# Altium project 智能柜控制模块.PrjPcb
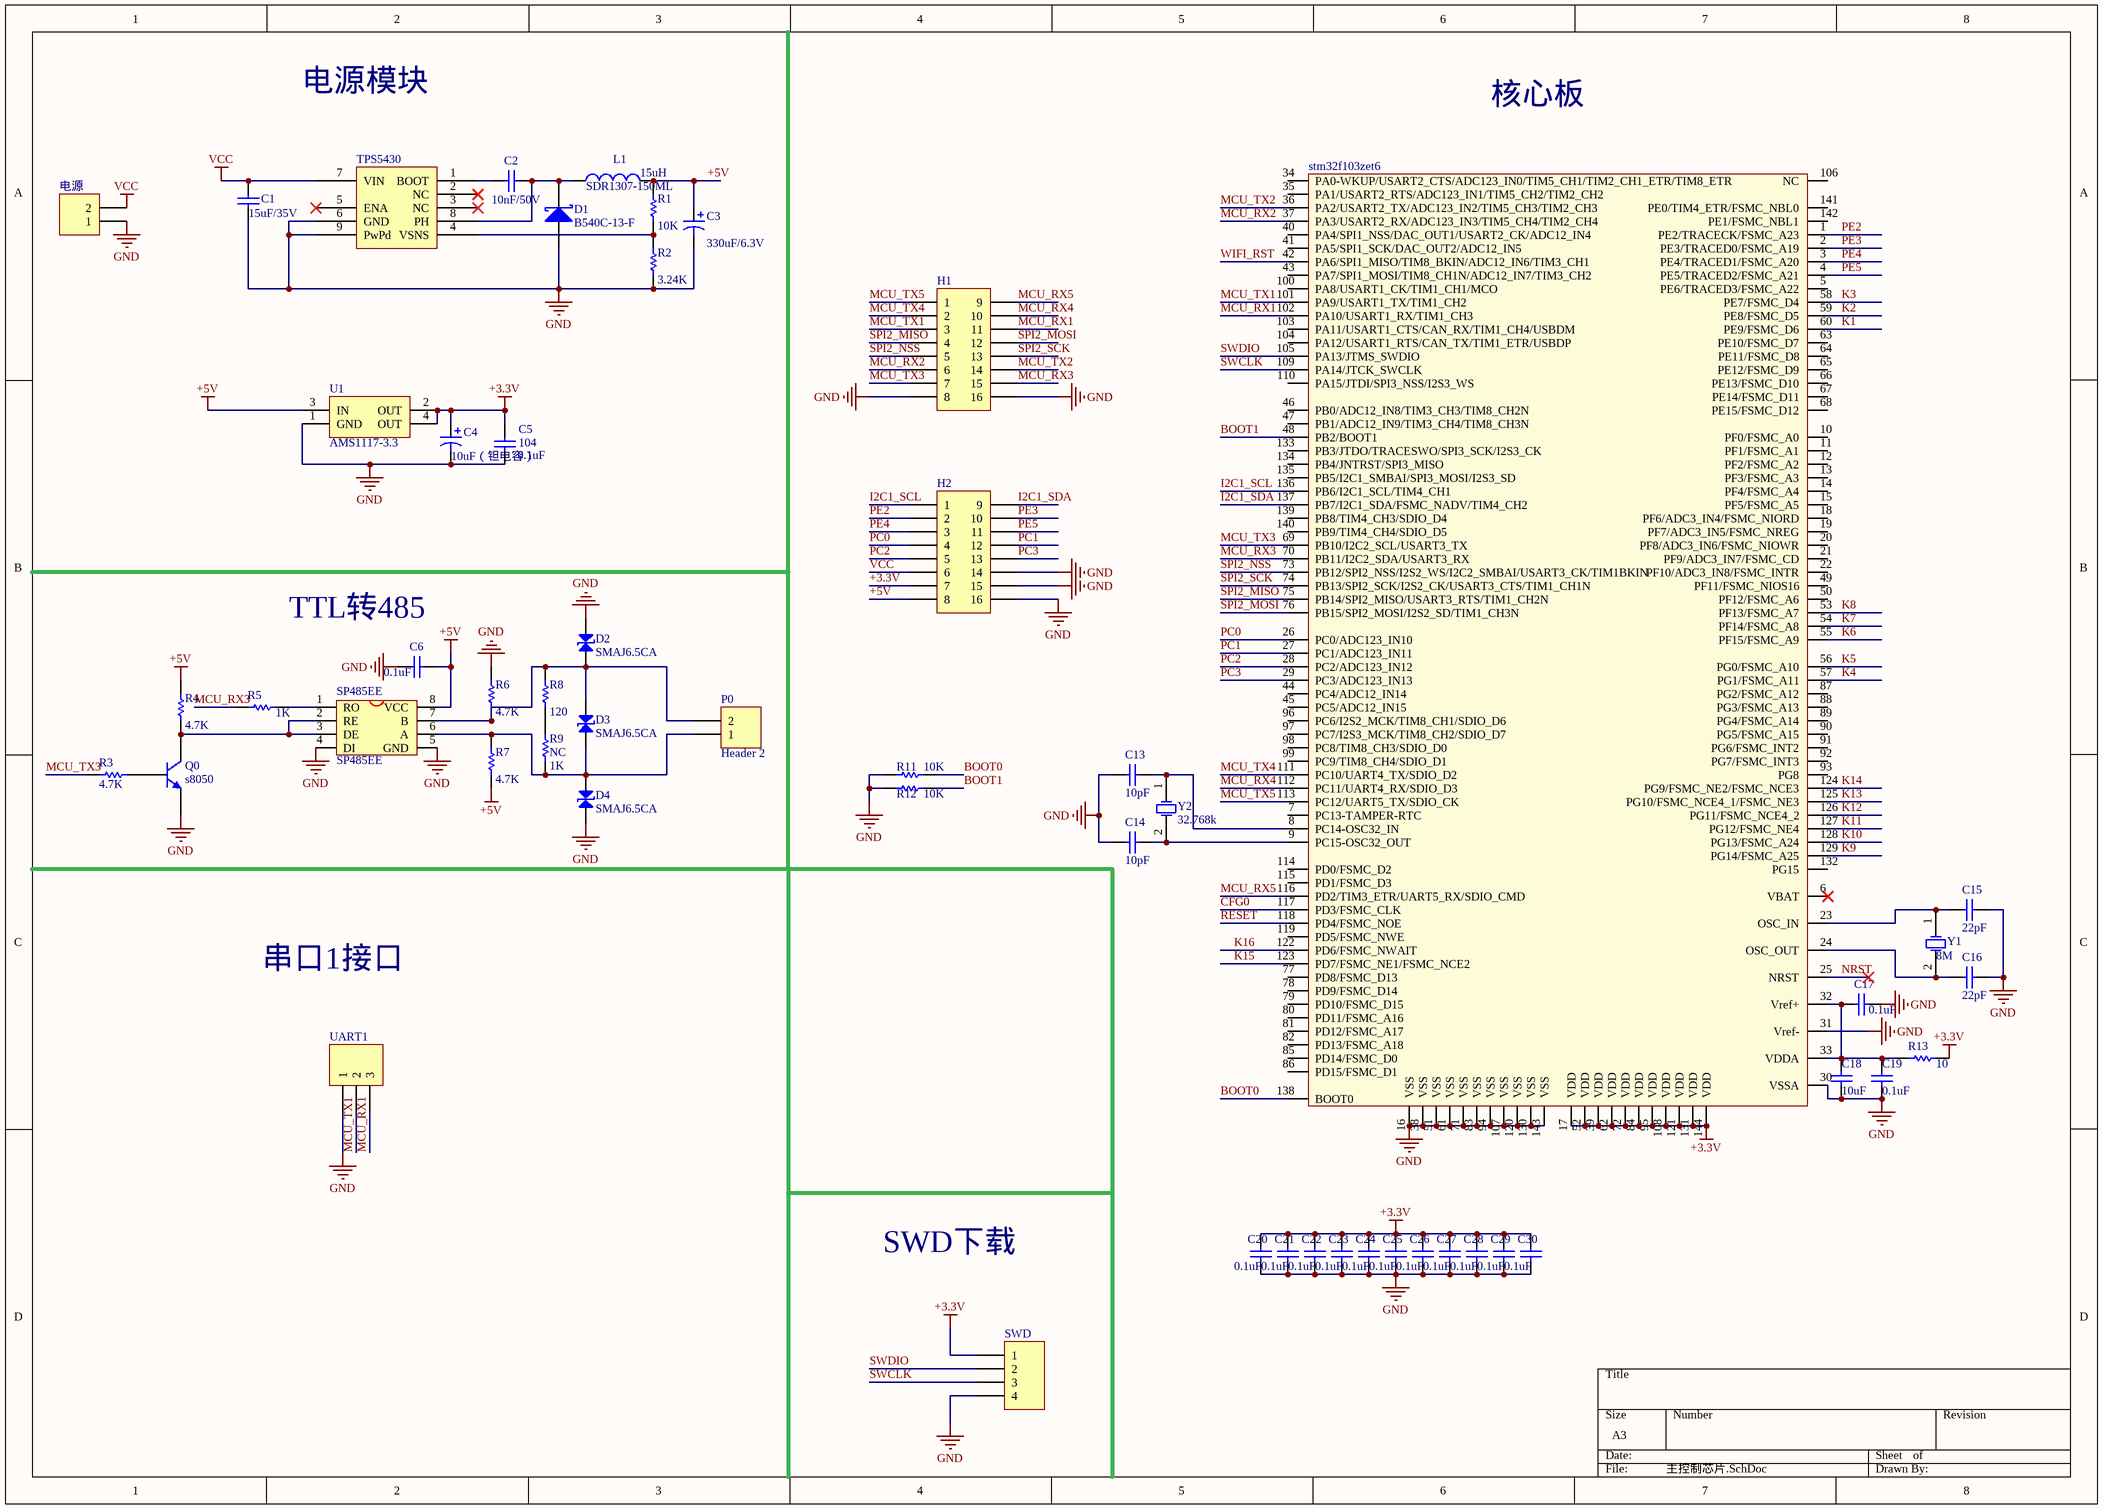
[diagram p0: 主控制芯片.SchDoc]
3 sheets, 230 parts. Net scope: global (net labels, ports and power ports of the same name join across sheets).
Board file: XNG_V1PCB.PcbDoc
Sheets:
  主控制芯片.SchDoc
  以太网透传模块.SchDoc
  继电器模块.SchDoc

## Sheet 主控制芯片.SchDoc
size A3

### Parts
C1  value 15uF/35V  [1206]  (hidden comment: C2012X5R1V156M125AC)
C2  value 10nF/50V  [0603]  (hidden comment: C0805C103K5RACTU)
C3  value 330uF/6.3V  [钽电容(D)]  (hidden comment: 6TPC330MA)
C4  10uF（钽电容）  [钽电容(B)]
C5  104  value 0.1uF  [0603]
C6  value 0.1uF  [0603]  (hidden comment: 104)
C13  value 10pF  [0603]  (hidden comment: 10)
C14  value 10pF  [0603]  (hidden comment: 10)
C15  value 22pF  [0603]  (hidden comment: 22)
C16  value 22pF  [0603]  (hidden comment: 22)
C17  value 0.1uF  [0603]  (hidden comment: 104)
C18  value 10uF  [0603]  (hidden comment: 106)
C19  value 0.1uF  [0603]  (hidden comment: 104)
C20  value 0.1uF  [0603]  (hidden comment: 104)
C21  value 0.1uF  [0603]  (hidden comment: 104)
C22  value 0.1uF  [0603]  (hidden comment: 104)
C23  value 0.1uF  [0603]  (hidden comment: 104)
C24  value 0.1uF  [0603]  (hidden comment: 104)
C25  value 0.1uF  [0603]  (hidden comment: 104)
C26  value 0.1uF  [0603]  (hidden comment: 104)
C27  value 0.1uF  [0603]  (hidden comment: 104)
C28  value 0.1uF  [0603]  (hidden comment: 104)
C29  value 0.1uF  [0603]  (hidden comment: 104)
C30  value 0.1uF  [0603]  (hidden comment: 104)
D1  B540C-13-F  [SMC]
D2  SMAJ6.5CA  [SMA]
D3  SMAJ6.5CA  [SMA]
D4  SMAJ6.5CA  [SMA]
H1  Header 8X2A  [HDR2X8_CEN]  (value not drawn)
H2  Header 8X2A  [HDR2X8_CEN]  (value not drawn)
L1  SDR1307-150ML  value 15uH  [CDRH127]
P0  Header 2  [电源]
Q0  s8050  [SOT-23]
R1  10K  [0603]
R2  3.24K  [0603]
R3  4.7k  [0603]
R4  4.7k  [0603]
R5  1K  [0603]
R6  4.7k  [0603]
R7  4.7k  [0603]
R8  120  [0603]
R9  NC  value 1K  [0603]
R11  10K  [0603]
R12  10K  [0603]
R13  10  [0603]
SP485EE  SP485EE  [SOP-8]
stm32f103zet6  stm32f103zet6  [LQFP144]  (value not drawn)
SWD  Header 4  [SWD]  (value not drawn)
TPS5430  TPS5430DDAR  [TPS5430]  (value not drawn)
U1  AMS1117-3.3  [1117-3.3]
UART1  Header 3  [H3]  (value not drawn)
Y1  8M  [5032(8M)]
Y2  32.768k  [FC135(32.768K)]
电源  DUANZI  [电源]  (value not drawn)

### Nets
+3.3V: C4.1 C5.2 C20.1 C21.1 C22.1 C23.1 C24.1 C25.1 C26.1 C27.1 C28.1 C29.1 C30.1 H2.7 R13.2 stm32f103zet6.17(VDD) stm32f103zet6.39(VDD) stm32f103zet6.52(VDD) stm32f103zet6.62(VDD) stm32f103zet6.72(VDD) stm32f103zet6.84(VDD) stm32f103zet6.95(VDD) stm32f103zet6.108(VDD) stm32f103zet6.121(VDD) stm32f103zet6.131(VDD) stm32f103zet6.144(VDD) SWD.1 U1.2(OUT) U1.4(OUT)
+5V: C3.1 C6.2 H2.8 L1.2 R1.2 R4.1 R7.2 SP485EE.8(VCC) U1.3(IN)
GND: C1.2 C3.2 C4.2 C5.1 C6.1 C13.2 C14.2 C15.1 C16.1 C17.1 C18.2 C19.2 C20.2 C21.2 C22.2 C23.2 C24.2 C25.2 C26.2 C27.2 C28.2 C29.2 C30.2 D1.1(A) D2.2 D4.1 H1.8 H1.16 H2.14 H2.15 H2.16 Q0.3(E) R2.1 R6.1 R11.2 R12.2 SP485EE.4(DI) SP485EE.5(GND) stm32f103zet6.16(VSS) stm32f103zet6.30(VSSA) stm32f103zet6.31(Vref-) stm32f103zet6.38(VSS) stm32f103zet6.51(VSS) stm32f103zet6.61(VSS) stm32f103zet6.71(VSS) stm32f103zet6.83(VSS) stm32f103zet6.94(VSS) stm32f103zet6.107(VSS) stm32f103zet6.120(VSS) stm32f103zet6.130(VSS) stm32f103zet6.143(VSS) SWD.4 TPS5430.6(GND) TPS5430.9(PwPd) U1.1(GND) UART1.1 电源.1
VCC: C1.1 H2.6 TPS5430.7(VIN) 电源.2
BOOT0: R11.1 stm32f103zet6.138(BOOT0)
BOOT1: R12.1 stm32f103zet6.48(PB2/BOOT1)
CFG0: stm32f103zet6.117(PD3/FSMC_CLK)
I2C1_SCL: H2.1 stm32f103zet6.136(PB6/I2C1_SCL/TIM4_CH1)
I2C1_SDA: H2.9 stm32f103zet6.137(PB7/I2C1_SDA/FSMC_NADV/TIM4_CH2)
K1: stm32f103zet6.60(PE9/FSMC_D6)
K2: stm32f103zet6.59(PE8/FSMC_D5)
K3: stm32f103zet6.58(PE7/FSMC_D4)
K4: stm32f103zet6.57(PG1/FSMC_A11)
K5: stm32f103zet6.56(PG0/FSMC_A10)
K6: stm32f103zet6.55(PF15/FSMC_A9)
K7: stm32f103zet6.54(PF14/FSMC_A8)
K8: stm32f103zet6.53(PF13/FSMC_A7)
K9: stm32f103zet6.129(PG14/FSMC_A25)
K10: stm32f103zet6.128(PG13/FSMC_A24)
K11: stm32f103zet6.127(PG12/FSMC_NE4)
K12: stm32f103zet6.126(PG11/FSMC_NCE4_2)
K13: stm32f103zet6.125(PG10/FSMC_NCE4_1/FSMC_NE3)
K14: stm32f103zet6.124(PG9/FSMC_NE2/FSMC_NCE3)
K15: stm32f103zet6.123(PD7/FSMC_NE1/FSMC_NCE2)
K16: stm32f103zet6.122(PD6/FSMC_NWAIT)
MCU_RX1: H1.11 stm32f103zet6.102(PA10/USART1_RX/TIM1_CH3) UART1.3
MCU_RX2: H1.6 stm32f103zet6.37(PA3/USART2_RX/ADC123_IN3/TIM5_CH4/TIM2_CH4)
MCU_RX3: H1.15 R5.1 stm32f103zet6.70(PB11/I2C2_SDA/USART3_RX)
MCU_RX4: H1.10 stm32f103zet6.112(PC11/UART4_RX/SDIO_D3)
MCU_RX5: H1.9 stm32f103zet6.116(PD2/TIM3_ETR/UART5_RX/SDIO_CMD)
MCU_TX1: H1.3 stm32f103zet6.101(PA9/USART1_TX/TIM1_CH2) UART1.2
MCU_TX2: H1.14 stm32f103zet6.36(PA2/USART2_TX/ADC123_IN2/TIM5_CH3/TIM2_CH3)
MCU_TX3: H1.7 R3.1 stm32f103zet6.69(PB10/I2C2_SCL/USART3_TX)
MCU_TX4: H1.2 stm32f103zet6.111(PC10/UART4_TX/SDIO_D2)
MCU_TX5: H1.1 stm32f103zet6.113(PC12/UART5_TX/SDIO_CK)
NRST: stm32f103zet6.25(NRST)
PC0: H2.4 stm32f103zet6.26(PC0/ADC123_IN10)
PC1: H2.12 stm32f103zet6.27(PC1/ADC123_IN11)
PC2: H2.5 stm32f103zet6.28(PC2/ADC123_IN12)
PC3: H2.13 stm32f103zet6.29(PC3/ADC123_IN13)
PE2: H2.2 stm32f103zet6.1(PE2/TRACECK/FSMC_A23)
PE3: H2.10 stm32f103zet6.2(PE3/TRACED0/FSMC_A19)
PE4: H2.3 stm32f103zet6.3(PE4/TRACED1/FSMC_A20)
PE5: H2.11 stm32f103zet6.4(PE5/TRACED2/FSMC_A21)
RESET: stm32f103zet6.118(PD4/FSMC_NOE)
SPI2_MISO: H1.4 stm32f103zet6.75(PB14/SPI2_MISO/USART3_RTS/TIM1_CH2N)
SPI2_MOSI: H1.12 stm32f103zet6.76(PB15/SPI2_MOSI/I2S2_SD/TIM1_CH3N)
SPI2_NSS: H1.5 stm32f103zet6.73(PB12/SPI2_NSS/I2S2_WS/I2C2_SMBAI/USART3_CK/TIM1BKIN)
SPI2_SCK: H1.13 stm32f103zet6.74(PB13/SPI2_SCK/I2S2_CK/USART3_CTS/TIM1_CH1N)
SWCLK: stm32f103zet6.109(PA14/JTCK_SWCLK) SWD.3
SWDIO: stm32f103zet6.105(PA13/JTMS_SWDIO) SWD.2
WIFI_RST: stm32f103zet6.42(PA6/SPI1_MISO/TIM8_BKIN/ADC12_IN6/TIM3_CH1)
NetC2_1: C2.1 TPS5430.1(BOOT)
NetC2_2: C2.2 D1.2(K) L1.1 TPS5430.8(PH)
NetC13_1: C13.1 stm32f103zet6.8(PC14-OSC32_IN) Y2.1(OSC1)
NetC14_1: C14.1 stm32f103zet6.9(PC15-OSC32_OUT) Y2.2(OSC2)
NetC15_2: C15.2 stm32f103zet6.23(OSC_IN) Y1.1(OSC1)
NetC16_2: C16.2 stm32f103zet6.24(OSC_OUT) Y1.2(OSC2)
NetC17_2: C17.2 C18.1 C19.1 R13.1 stm32f103zet6.32(Vref+) stm32f103zet6.33(VDDA)
NetD2_1: D2.1 D3.2 P0.2 R6.2 R8.2 SP485EE.7(B)
NetD3_1: D3.1 D4.2 P0.1 R7.1 R9.1 SP485EE.6(A)
NetQ0_1: Q0.1(C) R4.2 SP485EE.2(RE) SP485EE.3(DE)
NetQ0_2: Q0.2(B) R3.2
NetR1_1: R1.1 R2.2 TPS5430.4(VSNS)
NetR5_2: R5.2 SP485EE.1(RO)
NetR8_1: R8.1 R9.2

Not connected (* = marked no-connect by the designer): stm32f103zet6 5(PE6/TRACED3/FSMC_A22) 6(VBAT)* 7(PC13-TAMPER-RTC) 10(PF0/FSMC_A0) 11(PF1/FSMC_A1) 12(PF2/FSMC_A2) 13(PF3/FSMC_A3) 14(PF4/FSMC_A4) 15(PF5/FSMC_A5) 18(PF6/ADC3_IN4/FSMC_NIORD) 19(PF7/ADC3_IN5/FSMC_NREG) 20(PF8/ADC3_IN6/FSMC_NIOWR) 21(PF9/ADC3_IN7/FSMC_CD) 22(PF10/ADC3_IN8/FSMC_INTR) 34(PA0-WKUP/USART2_CTS/ADC123_IN0/TIM5_CH1/TIM2_CH1_ETR/TIM8_ETR) 35(PA1/USART2_RTS/ADC123_IN1/TIM5_CH2/TIM2_CH2) 40(PA4/SPI1_NSS/DAC_OUT1/USART2_CK/ADC12_IN4) 41(PA5/SPI1_SCK/DAC_OUT2/ADC12_IN5) 43(PA7/SPI1_MOSI/TIM8_CH1N/ADC12_IN7/TIM3_CH2) 44(PC4/ADC12_IN14) 45(PC5/ADC12_IN15) 46(PB0/ADC12_IN8/TIM3_CH3/TIM8_CH2N) 47(PB1/ADC12_IN9/TIM3_CH4/TIM8_CH3N) 49(PF11/FSMC_NIOS16) 50(PF12/FSMC_A6) 63(PE10/FSMC_D7) 64(PE11/FSMC_D8) 65(PE12/FSMC_D9) 66(PE13/FSMC_D10) 67(PE14/FSMC_D11) 68(PE15/FSMC_D12) 77(PD8/FSMC_D13) 78(PD9/FSMC_D14) 79(PD10/FSMC_D15) 80(PD11/FSMC_A16) 81(PD12/FSMC_A17) 82(PD13/FSMC_A18) 85(PD14/FSMC_D0) 86(PD15/FSMC_D1) 87(PG2/FSMC_A12) 88(PG3/FSMC_A13) 89(PG4/FSMC_A14) 90(PG5/FSMC_A15) 91(PG6/FSMC_INT2) 92(PG7/FSMC_INT3) 93(PG8) 96(PC6/I2S2_MCK/TIM8_CH1/SDIO_D6) 97(PC7/I2S3_MCK/TIM8_CH2/SDIO_D7) 98(PC8/TIM8_CH3/SDIO_D0) 99(PC9/TIM8_CH4/SDIO_D1) 100(PA8/USART1_CK/TIM1_CH1/MCO) 103(PA11/USART1_CTS/CAN_RX/TIM1_CH4/USBDM) 104(PA12/USART1_RTS/CAN_TX/TIM1_ETR/USBDP) 106(NC) 110(PA15/JTDI/SPI3_NSS/I2S3_WS) 114(PD0/FSMC_D2) 115(PD1/FSMC_D3) 119(PD5/FSMC_NWE) 132(PG15) 133(PB3/JTDO/TRACESWO/SPI3_SCK/I2S3_CK) 134(PB4/JNTRST/SPI3_MISO) 135(PB5/I2C1_SMBAI/SPI3_MOSI/I2S3_SD) 139(PB8/TIM4_CH3/SDIO_D4) 140(PB9/TIM4_CH4/SDIO_D5) 141(PE0/TIM4_ETR/FSMC_NBL0) 142(PE1/FSMC_NBL1); TPS5430 2(NC)* 3(NC)* 5(ENA)*

### Notes on the sheet
- 电源模块
- 核心板
- (near C6) TTL转485
- 串口1接口
- SWD下载

### Library data of the parts
C1 C2 C5 C6 C13-C30 = Cap: Capacitor; Published: 8-Jun-2000; LatestRevisionDate: 17-Jul-2002; LatestRevisionNote: Re-released for DXP Platform.; PackageReference: RAD-0.3; Publisher: Altium Limited
  C1 C2 C6 C17-C19: PackageDescription: Radial Cap, Thru-Hole; 2 Leads; 0.3 in Pin Spacing
C3 = Cap Pol1: Polarized Capacitor (Radial); Published: 8-Jun-2000; LatestRevisionDate: 17-Jul-2002; LatestRevisionNote: Re-released for DXP Platform.; PackageReference: RB7.6-15; Publisher: Altium Limited; PackageDescription: Polarized Capacitor (Radial); 2 Leads
C4 = Cap Pol1: Polarized Capacitor (Radial); Value: 10uF; Published: 8-Jun-2000; LatestRevisionDate: 17-Jul-2002; LatestRevisionNote: Re-released for DXP Platform.; PackageReference: RB7.6-15; Publisher: Altium Limited
D1 = D Schottky: Schottky Diode; Published: 8-Jun-2000; LatestRevisionDate: 17-Jul-2002; LatestRevisionNote: Re-released for DXP Platform.; PackageReference: SMB; Publisher: Altium Limited; PackageDescription: DO-214-AA/SMB; 2 C-Bend Leads; Body 5.3 x 3.6 mm, inc. leads (LxW); Code_JEDEC: DO-214-AA
D2-D4 = MSCJ6.5CA
H1 H2 = Header 8X2A: Header, 8-Pin, Dual row; LatestRevisionDate: 17-Jul-2002; LatestRevisionNote: Re-released for DXP Platform.; Publisher: Altium Limited
L1 = Inductor: Code_IEC: 1005; Published: 8-Jun-2000; LatestRevisionDate: 29-May-2009; LatestRevisionNote: IPC-7351 Footprint Added.; PackageReference: 0402-A; Publisher: Altium Limited; PackageDescription: Chip Inductor; Code_JEITA: 0402
P0 电源 = Header 2: Header, 2-Pin; LatestRevisionDate: 17-Jul-2002; LatestRevisionNote: Re-released for DXP Platform.; Publisher: Altium Limited
Q0 = NPN: NPN Bipolar Transistor; Published: 8-Jun-2000; LatestRevisionDate: 17-Jul-2002; LatestRevisionNote: Re-released for DXP Platform.; PackageReference: TO-226-AA; Publisher: Altium Limited; PackageDescription: TO, Flat Index; 3 In-Line, Axial Leads; Body Dia. 4.8mm; Leads 0.55 x 0.51 mm (max); Code_JEDEC: TO-226-AA
R1-R9 R11-R13 = Res1: Resistor; Published: 8-Jun-2000; LatestRevisionDate: 17-Jul-2002; LatestRevisionNote: Re-released for DXP Platform.; PackageReference: AXIAL-0.3; Publisher: Altium Limited; PackageDescription: Axial Device, Thru-Hole; 2 Leads; 0.3 in Pin Spacing
  R1 R11 R12: Value: 10K
  R2: Value: 3.24K
  R3 R4 R6 R7: Value: 4.7K
  R5: Value: 1K
  R8: Value: 120
  R13: Value: 10
SWD = Header 4: Header, 4-Pin; LatestRevisionDate: 17-Jul-2002; LatestRevisionNote: Re-released for DXP Platform.; Publisher: Altium Limited
TPS5430 = TPS5430
U1 = REG1117-3.3: 800mA and 1A Low Dropout Positive Regulator 2.85V, 3.3V, 5V, and Adjustable; Published: 8-Jun-2000; LatestRevisionDate: 17-Jul-2002; LatestRevisionNote: Re-released for DXP Platform.; DatasheetVersion: Sep-1997; PackageVersion: revC; PackageReference: ZZ311; Publisher: Altium Limited; PackageDescription: SOT-223/SC-73; 4 Leads; Body 6.7 x 7.3 mm, inc. leads (LxW max); ComponentLink1Description: Manufacturer Link; ComponentLink1URL: http://www.ti.com/; ComponentLink2Description: Datasheet; ComponentLink2URL: http://www-s.ti.com/sc/ds/REG1117.pdf
UART1 = Header 3: Header, 3-Pin; LatestRevisionDate: 17-Jul-2002; LatestRevisionNote: Re-released for DXP Platform.; Publisher: Altium Limited
Y1 Y2 = XTAL: Crystal Oscillator; Published: 8-Jun-2000; LatestRevisionDate: 17-Jul-2002; LatestRevisionNote: Re-released for DXP Platform.; PackageReference: R38; Publisher: Altium Limited

## Sheet 以太网透传模块.SchDoc
size A4
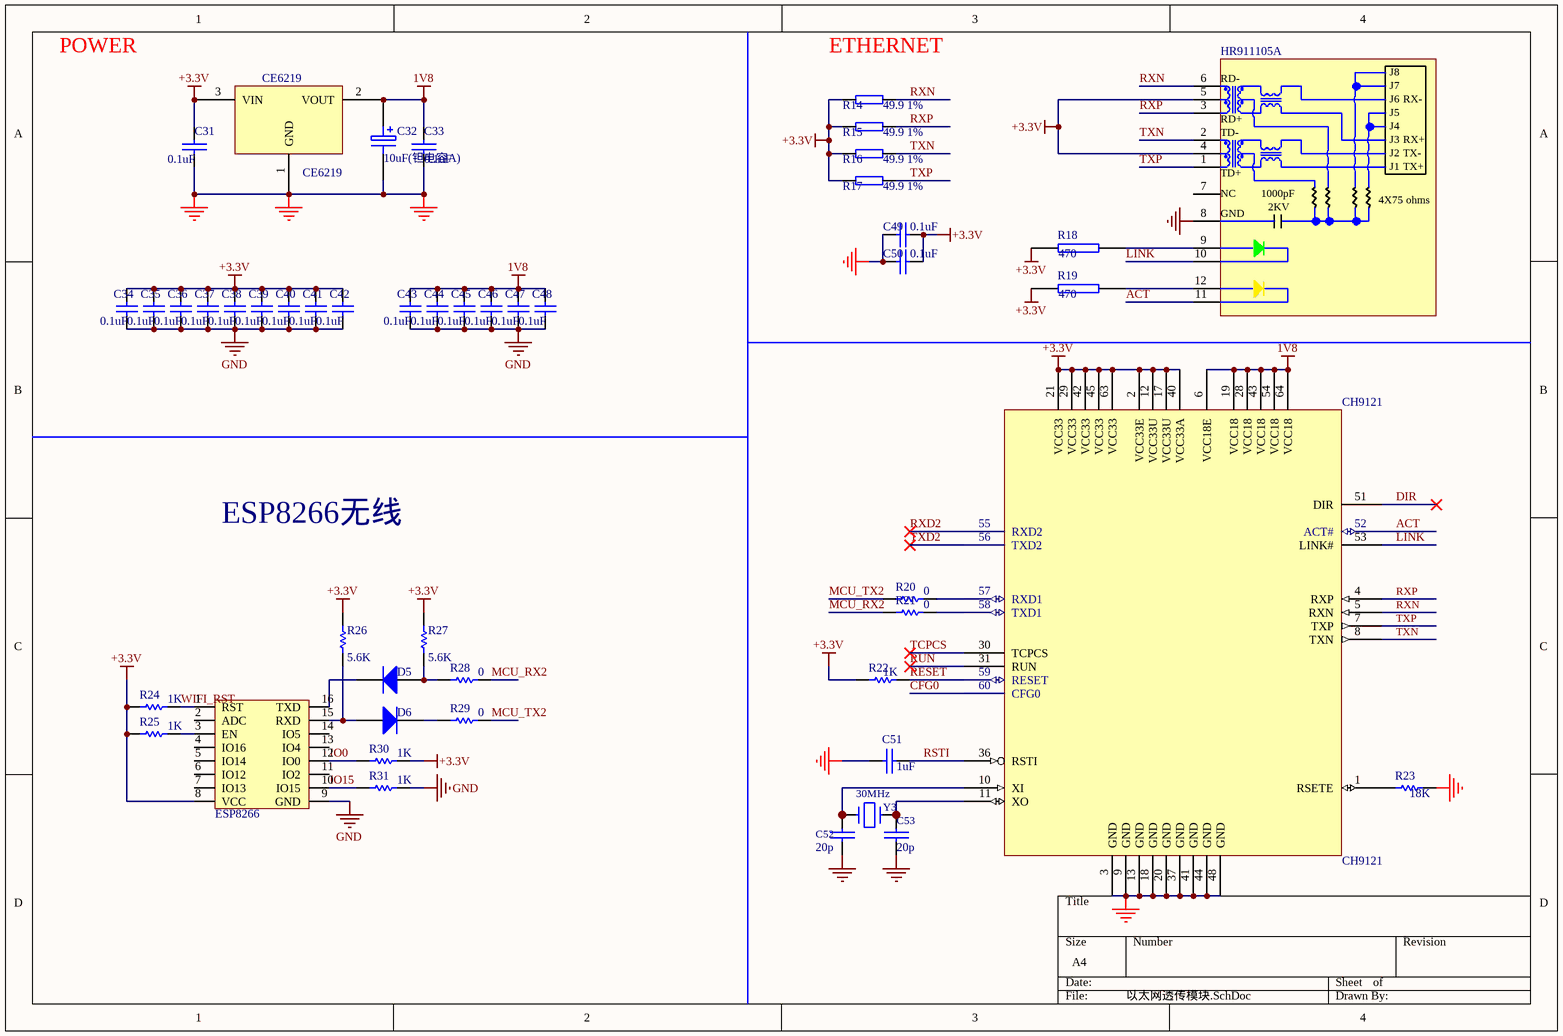
[diagram p1: 以太网透传模块.SchDoc]

### Parts
C31  104  [0603]  (value not drawn)
C32  10uF(钽电容A)  [钽电容(A)]
C33  104  [0603]  (value not drawn)
C34  value 0.1uF  [0603]  (hidden comment: 104)
C35  value 0.1uF  [0603]  (hidden comment: 104)
C36  value 0.1uF  [0603]  (hidden comment: 104)
C37  value 0.1uF  [0603]  (hidden comment: 104)
C38  value 0.1uF  [0603]  (hidden comment: 104)
C39  value 0.1uF  [0603]  (hidden comment: 104)
C40  value 0.1uF  [0603]  (hidden comment: 104)
C41  value 0.1uF  [0603]  (hidden comment: 104)
C42  value 0.1uF  [0603]  (hidden comment: 104)
C43  value 0.1uF  [0603]  (hidden comment: 104)
C44  value 0.1uF  [0603]  (hidden comment: 104)
C45  value 0.1uF  [0603]  (hidden comment: 104)
C46  value 0.1uF  [0603]  (hidden comment: 104)
C47  value 0.1uF  [0603]  (hidden comment: 104)
C48  value 0.1uF  [0603]  (hidden comment: 104)
C49  104  [0603]  (value not drawn)
C50  104  [0603]  (value not drawn)
C51  105  [0603]  (value not drawn)
C52  20  [0603]  (value not drawn)
C53  20  [0603]  (value not drawn)
CE6219  CE6219  [SOT-23]
CH9121  CH9121  [LQFP64_10x10]
D5  IN5819  [SOD-123]  (value not drawn)
D6  IN5819  [SOD-123]  (value not drawn)
ESP8266  ESP8266  [ESP8266]  (value not drawn)
HR911105A  HR911105A  [HR911105A]  (value not drawn)
R14  49.9 1%  [0603]
R15  49.9 1%  [0603]
R16  49.9 1%  [0603]
R17  49.9 1%  [0603]
R18  470  [0603]
R19  470  [0603]
R20  0  [0603]
R21  0  [0603]
R22  1K  [0603]
R23  18K  [0603]
R24  1K  [0603]
R25  1K  [0603]
R26  5.6K  [0603]
R27  5.6K  [0603]
R28  0  [0603]
R29  0  [0603]
R30  1K  [0603]
R31  1K  [0603]
Y3  30MHz  [4025]

### Nets
1V8: C32.1 C33.1 C43.1 C44.1 C45.1 C46.1 C47.1 C48.1 CE6219.2(VOUT) CH9121.6(VCC18E) CH9121.19(VCC18) CH9121.28(VCC18) CH9121.43(VCC18) CH9121.54(VCC18) CH9121.64(VCC18)
+3.3V: C31.1 C34.1 C35.1 C36.1 C37.1 C38.1 C39.1 C40.1 C41.1 C42.1 C49.1 C50.1 CE6219.3(VIN) CH9121.2(VCC33E) CH9121.12(VCC33U) CH9121.17(VCC33U) CH9121.21(VCC33) CH9121.29(VCC33) CH9121.40(VCC33A) CH9121.42(VCC33) CH9121.45(VCC33) CH9121.63(VCC33) ESP8266.8(VCC) HR911105A.4 HR911105A.5 R14.1 R15.1 R16.1 R17.1 R18.1 R19.1 R22.1 R24.1 R25.1 R26.2 R27.2 R30.2
GND: C31.2 C32.2 C33.2 C34.2 C35.2 C36.2 C37.2 C38.2 C39.2 C40.2 C41.2 C42.2 C43.2 C44.2 C45.2 C46.2 C47.2 C48.2 C49.2 C50.2 C51.1 C52.2 C53.2 CE6219.1(GND) CH9121.3(GND) CH9121.9(GND) CH9121.13(GND) CH9121.18(GND) CH9121.20(GND) CH9121.37(GND) CH9121.41(GND) CH9121.44(GND) CH9121.48(GND) ESP8266.9(GND) HR911105A.8 R23.2 R31.2
ACT: CH9121.52(ACT#) HR911105A.11
CFG0: CH9121.60(CFG0)
DIR: CH9121.51(DIR)
IO0: ESP8266.12(IO0) R30.1
IO15: ESP8266.10(IO15) R31.1
LINK: CH9121.53(LINK#) HR911105A.10
MCU_RX2: R21.1 R28.2
MCU_TX2: R20.1 R29.2
RESET: CH9121.59(RESET) R22.2
RSTI: C51.2 CH9121.36(RSTI)
RUN: CH9121.31(RUN)
RXD2: CH9121.55(RXD2)
RXN: CH9121.5(RXN) HR911105A.6 R14.2
RXP: CH9121.4(RXP) HR911105A.3 R15.2
TCPCS: CH9121.30(TCPCS)
TXD2: CH9121.56(TXD2)
TXN: CH9121.8(TXN) HR911105A.2 R16.2
TXP: CH9121.7(TXP) HR911105A.1 R17.2
WIFI_RST: ESP8266.1(RST) R24.2
NetC52_1: C52.1 CH9121.10(XI) Y3.1
NetC53_1: C53.1 CH9121.11(XO) Y3.2
NetCH9121_1: CH9121.1(RSETE) R23.1
NetCH9121_57: CH9121.57(RXD1) R20.2
NetCH9121_58: CH9121.58(TXD1) R21.2
NetD5_1: D5.1(A) R27.1 R28.1
NetD5_2: D5.2(K) ESP8266.16(TXD)
NetD6_1: D6.1(A) ESP8266.15(RXD) R26.1
NetD6_2: D6.2(K) R29.1
NetESP8266_3: ESP8266.3(EN) R25.2
NetHR911105A_9: HR911105A.9 R18.2
NetHR911105A_12: HR911105A.12 R19.2

Not connected (* = marked no-connect by the designer): ESP8266 2(ADC) 4(IO16) 5(IO14) 6(IO12) 7(IO13) 11(IO2) 13(IO4) 14(IO5); HR911105A 7

### Notes on the sheet
- POWER
- (near R14) ETHERNET
- ESP8266无线
- (in symbol CAP) 0.1uF; 1uF
- (in symbol HR911105A) J8; RD-; J7; J6; RX-; J5; RD+; J4; TD-; J3; RX+; J2; TX-; J1; TX+; TD+; NC; 1000pF; 4X75 ohms; 2KV; GND
- (in symbol Pro1BB.tmp_20p_7) 20p

### Library data of the parts
C31 C33 C49-C51 = CAP: Capacitor
C32 = ELECTRO1: Electrolytic Capacitor
C34-C48 = Cap: Capacitor; Published: 8-Jun-2000; LatestRevisionDate: 17-Jul-2002; LatestRevisionNote: Re-released for DXP Platform.; PackageReference: RAD-0.3; Publisher: Altium Limited
C52 C53 = Pro1BB.tmp_20p_7
CE6219 = LM1117_3.3V
D5 D6 = Diode 1N4001: 1 Amp General Purpose Rectifier; Published: 8-Jun-2000; LatestRevisionDate: 17-Jul-2002; LatestRevisionNote: Re-released for DXP Platform.; DatasheetVersion: 1998; PackageVersion: Aug-1999; PackageReference: DO-41; Publisher: Altium Limited; PackageDescription: Diode, Axial; Body 5.2 x 2.7 mm (LxDia. max), Lead Dia. 0.86 mm (max); Code_JEDEC: DO-204-AL; ComponentLink1Description: Manufacturer Link; ComponentLink1URL: http://www.fairchildsemi.com/; ComponentLink2Description: Datasheet; ComponentLink2URL: http://www.fairchildsemi.com/ds/1N%2F1N4001.pdf
R14-R17 = DZ
R18 R19 = RES2
R20-R31 = Res1: Resistor; Published: 8-Jun-2000; LatestRevisionDate: 17-Jul-2002; LatestRevisionNote: Re-released for DXP Platform.; PackageReference: AXIAL-0.3; Publisher: Altium Limited; PackageDescription: Axial Device, Thru-Hole; 2 Leads; 0.3 in Pin Spacing
  R20 R21 R28 R29: Value: 0
  R22 R24 R25 R30 R31: Value: 1K
  R23: Value: 18K
  R26 R27: Value: 5.6K
Y3 = Pro1BB.tmp_12MHz_6

## Sheet 继电器模块.SchDoc
size A3
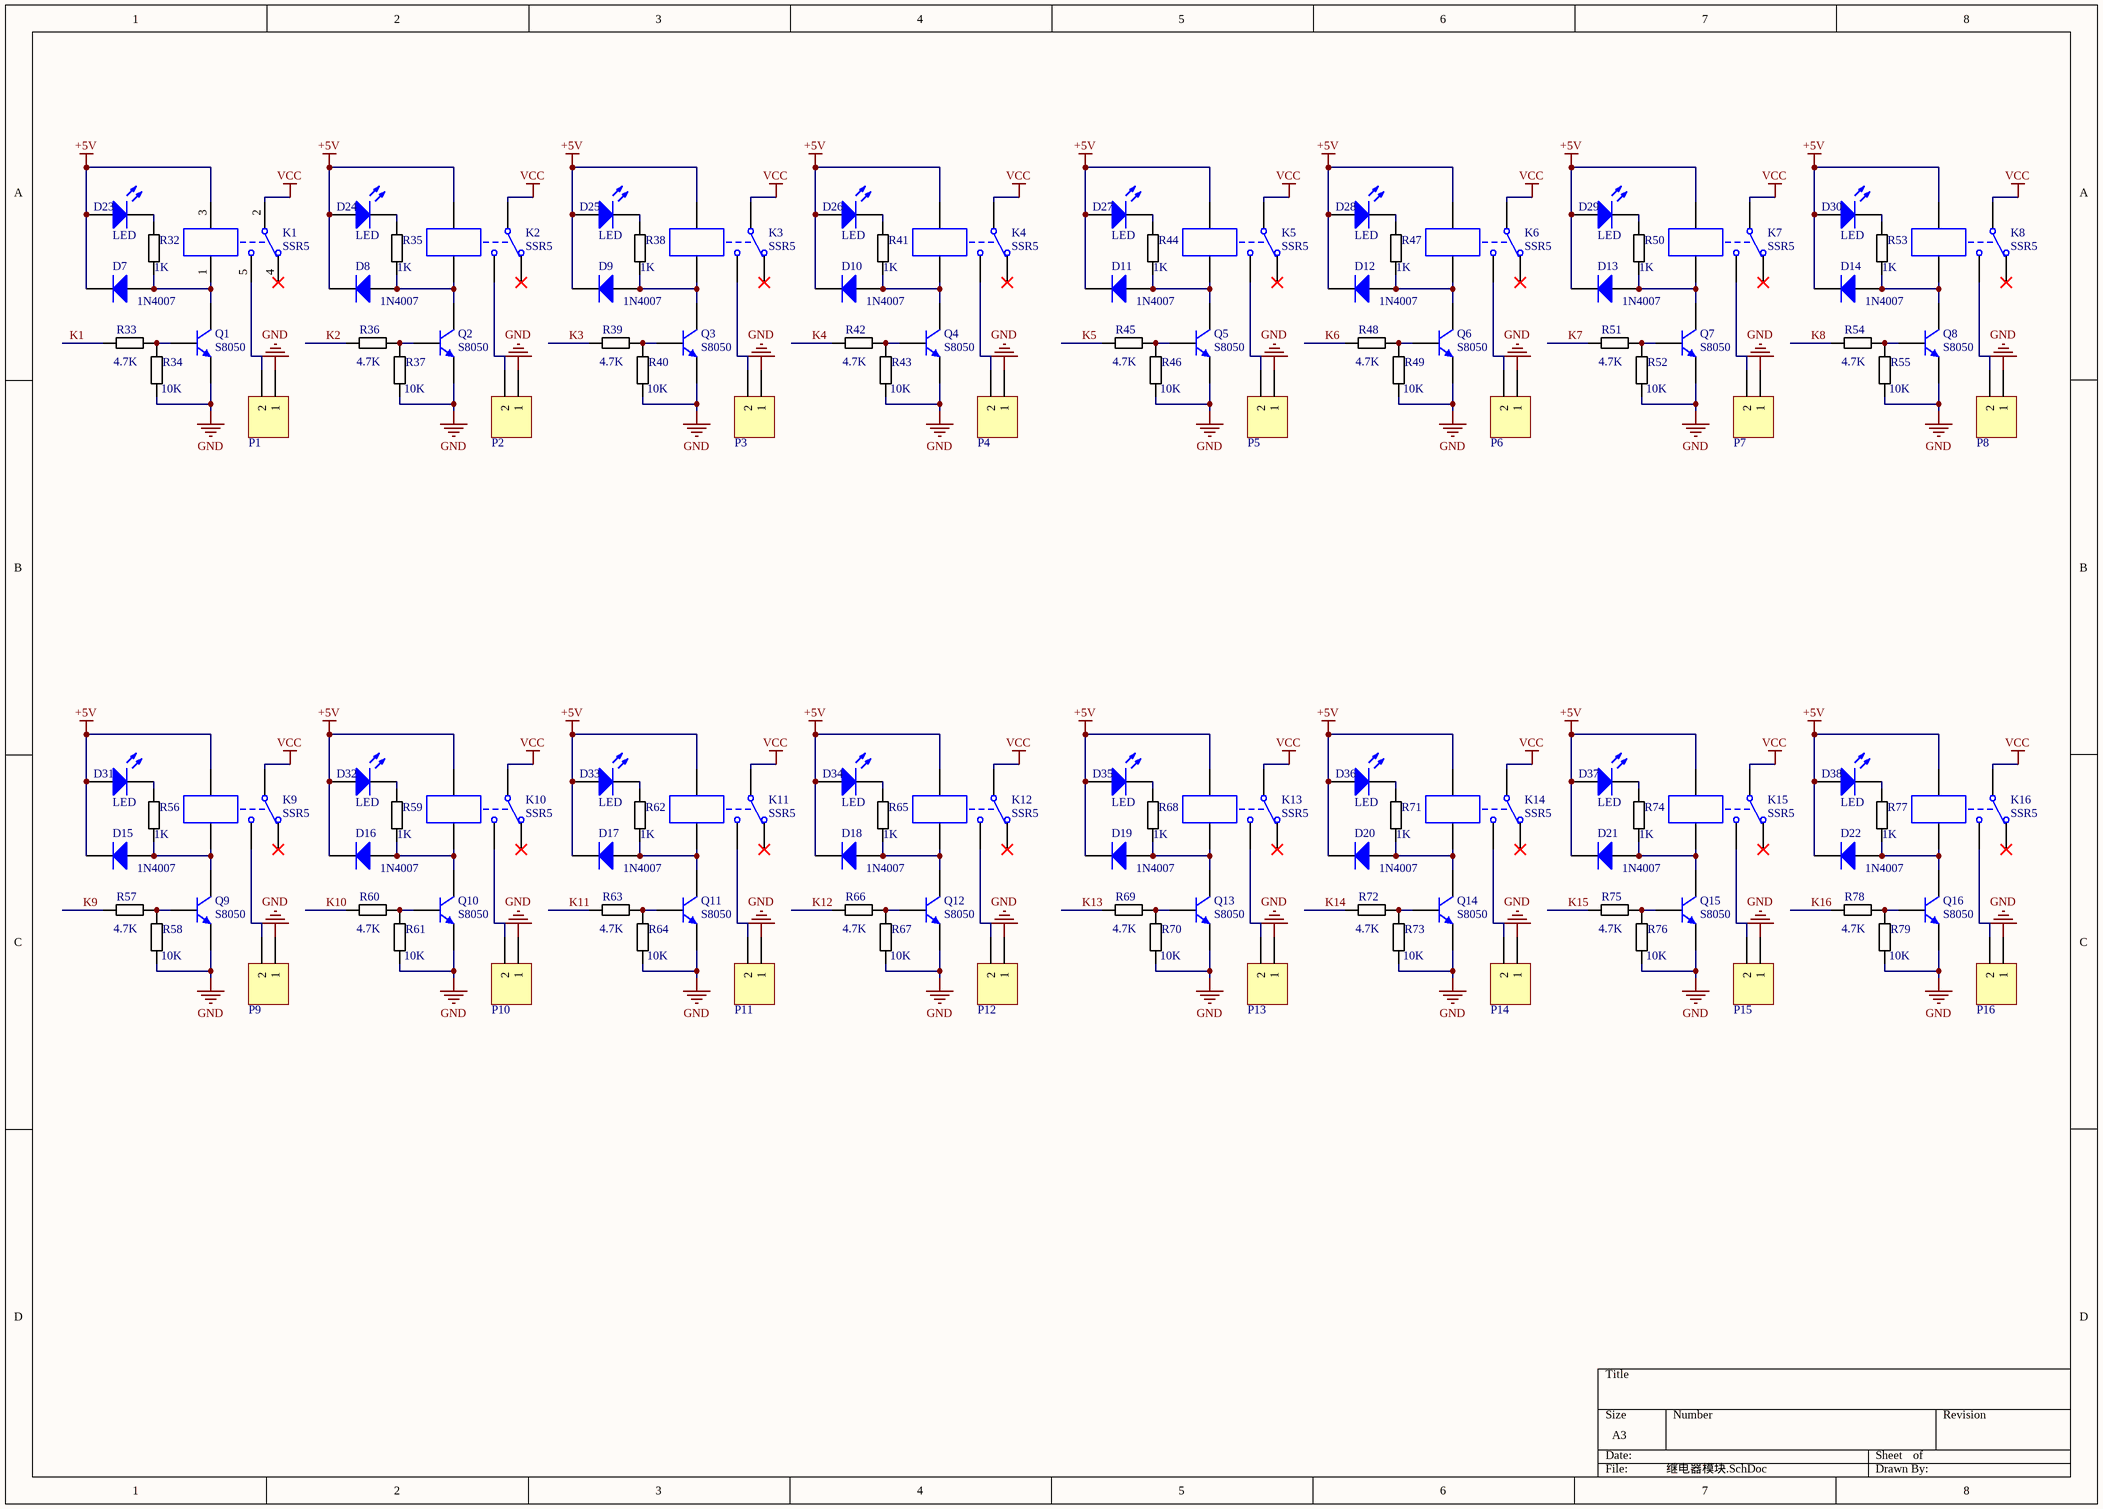
[diagram p2: 继电器模块.SchDoc]

### Parts
D7  1N4007  [SMA]
D8  1N4007  [SMA]
D9  1N4007  [SMA]
D10  1N4007  [SMA]
D11  1N4007  [SMA]
D12  1N4007  [SMA]
D13  1N4007  [SMA]
D14  1N4007  [SMA]
D15  1N4007  [SMA]
D16  1N4007  [SMA]
D17  1N4007  [SMA]
D18  1N4007  [SMA]
D19  1N4007  [SMA]
D20  1N4007  [SMA]
D21  1N4007  [SMA]
D22  1N4007  [SMA]
D23  LED  [LED]
D24  LED  [LED]
D25  LED  [LED]
D26  LED  [LED]
D27  LED  [LED]
D28  LED  [LED]
D29  LED  [LED]
D30  LED  [LED]
D31  LED  [LED]
D32  LED  [LED]
D33  LED  [LED]
D34  LED  [LED]
D35  LED  [LED]
D36  LED  [LED]
D37  LED  [LED]
D38  LED  [LED]
K1  SSR5  [SSR-DC5]
K2  SSR5  [SSR-DC5]
K3  SSR5  [SSR-DC5]
K4  SSR5  [SSR-DC5]
K5  SSR5  [SSR-DC5]
K6  SSR5  [SSR-DC5]
K7  SSR5  [SSR-DC5]
K8  SSR5  [SSR-DC5]
K9  SSR5  [SSR-DC5]
K10  SSR5  [SSR-DC5]
K11  SSR5  [SSR-DC5]
K12  SSR5  [SSR-DC5]
K13  SSR5  [SSR-DC5]
K14  SSR5  [SSR-DC5]
K15  SSR5  [SSR-DC5]
K16  SSR5  [SSR-DC5]
P1  Header 2  [电源]  (value not drawn)
P2  Header 2  [电源]  (value not drawn)
P3  Header 2  [电源]  (value not drawn)
P4  Header 2  [电源]  (value not drawn)
P5  Header 2  [电源]  (value not drawn)
P6  Header 2  [电源]  (value not drawn)
P7  Header 2  [电源]  (value not drawn)
P8  Header 2  [电源]  (value not drawn)
P9  Header 2  [电源]  (value not drawn)
P10  Header 2  [电源]  (value not drawn)
P11  Header 2  [电源]  (value not drawn)
P12  Header 2  [电源]  (value not drawn)
P13  Header 2  [电源]  (value not drawn)
P14  Header 2  [电源]  (value not drawn)
P15  Header 2  [电源]  (value not drawn)
P16  Header 2  [电源]  (value not drawn)
Q1  S8050  [SOT-23]
Q2  S8050  [SOT-23]
Q3  S8050  [SOT-23]
Q4  S8050  [SOT-23]
Q5  S8050  [SOT-23]
Q6  S8050  [SOT-23]
Q7  S8050  [SOT-23]
Q8  S8050  [SOT-23]
Q9  S8050  [SOT-23]
Q10  S8050  [SOT-23]
Q11  S8050  [SOT-23]
Q12  S8050  [SOT-23]
Q13  S8050  [SOT-23]
Q14  S8050  [SOT-23]
Q15  S8050  [SOT-23]
Q16  S8050  [SOT-23]
R32  1K  [0603]
R33  4.7K  [0603]
R34  10K  [0603]
R35  1K  [0603]
R36  4.7K  [0603]
R37  10K  [0603]
R38  1K  [0603]
R39  4.7K  [0603]
R40  10K  [0603]
R41  1K  [0603]
R42  4.7K  [0603]
R43  10K  [0603]
R44  1K  [0603]
R45  4.7K  [0603]
R46  10K  [0603]
R47  1K  [0603]
R48  4.7K  [0603]
R49  10K  [0603]
R50  1K  [0603]
R51  4.7K  [0603]
R52  10K  [0603]
R53  1K  [0603]
R54  4.7K  [0603]
R55  10K  [0603]
R56  1K  [0603]
R57  4.7K  [0603]
R58  10K  [0603]
R59  1K  [0603]
R60  4.7K  [0603]
R61  10K  [0603]
R62  1K  [0603]
R63  4.7K  [0603]
R64  10K  [0603]
R65  1K  [0603]
R66  4.7K  [0603]
R67  10K  [0603]
R68  1K  [0603]
R69  4.7K  [0603]
R70  10K  [0603]
R71  1K  [0603]
R72  4.7K  [0603]
R73  10K  [0603]
R74  1K  [0603]
R75  4.7K  [0603]
R76  10K  [0603]
R77  1K  [0603]
R78  4.7K  [0603]
R79  10K  [0603]

### Nets
+5V: D7.2(K) D8.2(K) D9.2(K) D10.2(K) D11.2(K) D12.2(K) D13.2(K) D14.2(K) D15.2(K) D16.2(K) D17.2(K) D18.2(K) D19.2(K) D20.2(K) D21.2(K) D22.2(K) D23.1(A) D24.1(A) D25.1(A) D26.1(A) D27.1(A) D28.1(A) D29.1(A) D30.1(A) D31.1(A) D32.1(A) D33.1(A) D34.1(A) D35.1(A) D36.1(A) D37.1(A) D38.1(A) K1.3 K2.3 K3.3 K4.3 K5.3 K6.3 K7.3 K8.3 K9.3 K10.3 K11.3 K12.3 K13.3 K14.3 K15.3 K16.3
GND: P1.1 P2.1 P3.1 P4.1 P5.1 P6.1 P7.1 P8.1 P9.1 P10.1 P11.1 P12.1 P13.1 P14.1 P15.1 P16.1 Q1.2(E) Q2.2(E) Q3.2(E) Q4.2(E) Q5.2(E) Q6.2(E) Q7.2(E) Q8.2(E) Q9.2(E) Q10.2(E) Q11.2(E) Q12.2(E) Q13.2(E) Q14.2(E) Q15.2(E) Q16.2(E) R34.2 R37.2 R40.2 R43.2 R46.2 R49.2 R52.2 R55.2 R58.2 R61.2 R64.2 R67.2 R70.2 R73.2 R76.2 R79.2
VCC: K1.2 K2.2 K3.2 K4.2 K5.2 K6.2 K7.2 K8.2 K9.2 K10.2 K11.2 K12.2 K13.2 K14.2 K15.2 K16.2
K1: R33.2
K2: R36.2
K3: R39.2
K4: R42.2
K5: R45.2
K6: R48.2
K7: R51.2
K8: R54.2
K9: R57.2
K10: R60.2
K11: R63.2
K12: R66.2
K13: R69.2
K14: R72.2
K15: R75.2
K16: R78.2
NetD7_1: D7.1(A) K1.1 Q1.3(C) R32.1
NetD8_1: D8.1(A) K2.1 Q2.3(C) R35.1
NetD9_1: D9.1(A) K3.1 Q3.3(C) R38.1
NetD10_1: D10.1(A) K4.1 Q4.3(C) R41.1
NetD11_1: D11.1(A) K5.1 Q5.3(C) R44.1
NetD12_1: D12.1(A) K6.1 Q6.3(C) R47.1
NetD13_1: D13.1(A) K7.1 Q7.3(C) R50.1
NetD14_1: D14.1(A) K8.1 Q8.3(C) R53.1
NetD15_1: D15.1(A) K9.1 Q9.3(C) R56.1
NetD16_1: D16.1(A) K10.1 Q10.3(C) R59.1
NetD17_1: D17.1(A) K11.1 Q11.3(C) R62.1
NetD18_1: D18.1(A) K12.1 Q12.3(C) R65.1
NetD19_1: D19.1(A) K13.1 Q13.3(C) R68.1
NetD20_1: D20.1(A) K14.1 Q14.3(C) R71.1
NetD21_1: D21.1(A) K15.1 Q15.3(C) R74.1
NetD22_1: D22.1(A) K16.1 Q16.3(C) R77.1
NetD23_2: D23.2(K) R32.2
NetD24_2: D24.2(K) R35.2
NetD25_2: D25.2(K) R38.2
NetD26_2: D26.2(K) R41.2
NetD27_2: D27.2(K) R44.2
NetD28_2: D28.2(K) R47.2
NetD29_2: D29.2(K) R50.2
NetD30_2: D30.2(K) R53.2
NetD31_2: D31.2(K) R56.2
NetD32_2: D32.2(K) R59.2
NetD33_2: D33.2(K) R62.2
NetD34_2: D34.2(K) R65.2
NetD35_2: D35.2(K) R68.2
NetD36_2: D36.2(K) R71.2
NetD37_2: D37.2(K) R74.2
NetD38_2: D38.2(K) R77.2
NetK1_5: K1.5 P1.2
NetK2_5: K2.5 P2.2
NetK3_5: K3.5 P3.2
NetK4_5: K4.5 P4.2
NetK5_5: K5.5 P5.2
NetK6_5: K6.5 P6.2
NetK7_5: K7.5 P7.2
NetK8_5: K8.5 P8.2
NetK9_5: K9.5 P9.2
NetK10_5: K10.5 P10.2
NetK11_5: K11.5 P11.2
NetK12_5: K12.5 P12.2
NetK13_5: K13.5 P13.2
NetK14_5: K14.5 P14.2
NetK15_5: K15.5 P15.2
NetK16_5: K16.5 P16.2
NetQ1_1: Q1.1(B) R33.1 R34.1
NetQ2_1: Q2.1(B) R36.1 R37.1
NetQ3_1: Q3.1(B) R39.1 R40.1
NetQ4_1: Q4.1(B) R42.1 R43.1
NetQ5_1: Q5.1(B) R45.1 R46.1
NetQ6_1: Q6.1(B) R48.1 R49.1
NetQ7_1: Q7.1(B) R51.1 R52.1
NetQ8_1: Q8.1(B) R54.1 R55.1
NetQ9_1: Q9.1(B) R57.1 R58.1
NetQ10_1: Q10.1(B) R60.1 R61.1
NetQ11_1: Q11.1(B) R63.1 R64.1
NetQ12_1: Q12.1(B) R66.1 R67.1
NetQ13_1: Q13.1(B) R69.1 R70.1
NetQ14_1: Q14.1(B) R72.1 R73.1
NetQ15_1: Q15.1(B) R75.1 R76.1
NetQ16_1: Q16.1(B) R78.1 R79.1

Not connected (* = marked no-connect by the designer): K1 4*; K2 4*; K3 4*; K4 4*; K5 4*; K6 4*; K7 4*; K8 4*; K9 4*; K10 4*; K11 4*; K12 4*; K13 4*; K14 4*; K15 4*; K16 4*

### Library data of the parts
D7-D22 = Diode 1N4007: 1 Amp General Purpose Rectifier; Published: 8-Jun-2000; LatestRevisionDate: 17-Jul-2002; LatestRevisionNote: Re-released for DXP Platform.; DatasheetVersion: 1998; PackageVersion: Aug-1999; PackageReference: DO-41; Publisher: Altium Limited; Code_JEDEC: DO-204-AL; ComponentLink1Description: Manufacturer Link; ComponentLink1URL: http://www.fairchildsemi.com/; ComponentLink2Description: Datasheet; ComponentLink2URL: http://www.fairchildsemi.com/ds/1N%2F1N4001.pdf
P1-P16 = Header 2: Header, 2-Pin; LatestRevisionDate: 17-Jul-2002; LatestRevisionNote: Re-released for DXP Platform.; Publisher: Altium Limited
R32-R79 = RES-1K
  R32 R35 R38 R41 R44 R47 R50 R53 R56 R59 R62 R65 R68 R71 R74 R77: Value: 1K
  R33 R36 R39 R42 R45 R48 R51 R54 R57 R60 R63 R66 R69 R72 R75 R78: Value: 4.7K
  R34 R37 R40 R43 R46 R49 R52 R55 R58 R61 R64 R67 R70 R73 R76 R79: Value: 10K
K1-K16 = SSR5: Published: 24-Mar-1999; LatestRevisionDate: 17-Jul-2002; LatestRevisionNote: Re-released for DXP Platform.; PackageReference: MODULE5B; Publisher: Altium Limited

## Nets that join several sheets
+3.3V: 主控制芯片 (29 pins), 以太网透传模块 (37 pins)
+5V: 主控制芯片 (9 pins), 继电器模块 (48 pins)
GND: 主控制芯片 (57 pins), 以太网透传模块 (37 pins), 继电器模块 (48 pins)
VCC: 主控制芯片 (C1.1 H2.6 TPS5430.7 电源.2), 继电器模块 (16 pins)
CFG0: 主控制芯片 (stm32f103zet6.117), 以太网透传模块 (CH9121.60)
K1: 主控制芯片 (stm32f103zet6.60), 继电器模块 (R33.2)
K2: 主控制芯片 (stm32f103zet6.59), 继电器模块 (R36.2)
K3: 主控制芯片 (stm32f103zet6.58), 继电器模块 (R39.2)
K4: 主控制芯片 (stm32f103zet6.57), 继电器模块 (R42.2)
K5: 主控制芯片 (stm32f103zet6.56), 继电器模块 (R45.2)
K6: 主控制芯片 (stm32f103zet6.55), 继电器模块 (R48.2)
K7: 主控制芯片 (stm32f103zet6.54), 继电器模块 (R51.2)
K8: 主控制芯片 (stm32f103zet6.53), 继电器模块 (R54.2)
K9: 主控制芯片 (stm32f103zet6.129), 继电器模块 (R57.2)
K10: 主控制芯片 (stm32f103zet6.128), 继电器模块 (R60.2)
K11: 主控制芯片 (stm32f103zet6.127), 继电器模块 (R63.2)
K12: 主控制芯片 (stm32f103zet6.126), 继电器模块 (R66.2)
K13: 主控制芯片 (stm32f103zet6.125), 继电器模块 (R69.2)
K14: 主控制芯片 (stm32f103zet6.124), 继电器模块 (R72.2)
K15: 主控制芯片 (stm32f103zet6.123), 继电器模块 (R75.2)
K16: 主控制芯片 (stm32f103zet6.122), 继电器模块 (R78.2)
MCU_RX2: 主控制芯片 (H1.6 stm32f103zet6.37), 以太网透传模块 (R21.1 R28.2)
MCU_TX2: 主控制芯片 (H1.14 stm32f103zet6.36), 以太网透传模块 (R20.1 R29.2)
RESET: 主控制芯片 (stm32f103zet6.118), 以太网透传模块 (CH9121.59 R22.2)
WIFI_RST: 主控制芯片 (stm32f103zet6.42), 以太网透传模块 (ESP8266.1 R24.2)